# EAGLE design PCB-ACMSL (EAGLE 6.4)
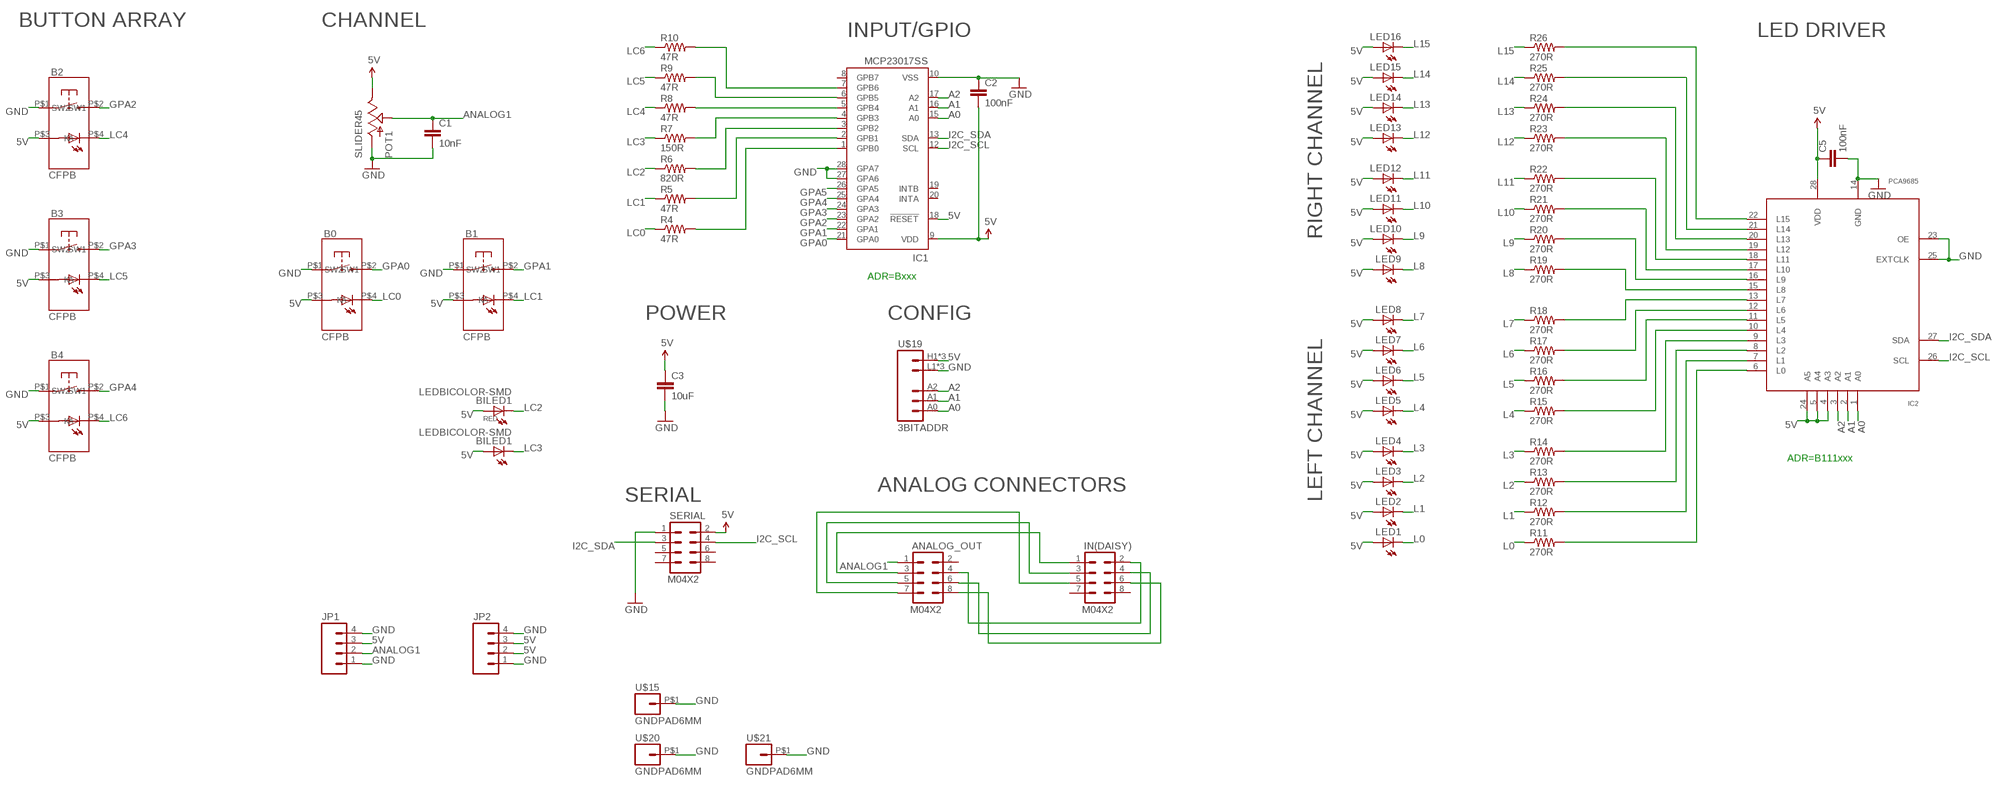
[diagram p0: schematic, sheet 1]

## Parts
ANALOG_OUT  M04X2  [2X4]
B0  CFPB  [CFPB-6/9MM]
B1  CFPB  [CFPB-6/9MM]
B2  CFPB  [CFPB-6/9MM]
B3  CFPB  [CFPB-6/9MM]
B4  CFPB  [CFPB-6/9MM]
BILED1  LEDBICOLOR-SMD  [LEDBICOLOR-SMD]
C1  10nF  CAP0603-CAP  [0603-CAP]
C2  100nF  CAP0603-CAP  [0603-CAP]
C3  10uF  CAP0805  [0805]
C5  100nF  CAP0603-CAP  [0603-CAP]
IC1  MCP23017SS  [SSOP28]
IC2  PCA9685  [TSSOP28]
IN(DAISY)  M04X2  [2X4]
JP1  M04PTH  [1X04]
JP2  M04PTH  [1X04]
LED1  LED3MM  [LED3MM]
LED2  LED3MM  [LED3MM]
LED3  LED3MM  [LED3MM]
LED4  LED3MM  [LED3MM]
LED5  LED3MM  [LED3MM]
LED6  LED3MM  [LED3MM]
LED7  LED3MM  [LED3MM]
LED8  LED3MM  [LED3MM]
LED9  LED3MM  [LED3MM]
LED10  LED3MM  [LED3MM]
LED11  LED3MM  [LED3MM]
LED12  LED3MM  [LED3MM]
LED13  LED3MM  [LED3MM]
LED14  LED3MM  [LED3MM]
LED15  LED3MM  [LED3MM]
LED16  LED3MM  [LED3MM]
POT1  SLIDER45  [SLIDER45]
R4  47R  RESISTOR0603-RES  [0603-RES]
R5  47R  RESISTOR0603-RES  [0603-RES]
R6  820R  RESISTOR0603-RES  [0603-RES]
R7  150R  RESISTOR0603-RES  [0603-RES]
R8  47R  RESISTOR0603-RES  [0603-RES]
R9  47R  RESISTOR0603-RES  [0603-RES]
R10  47R  RESISTOR0603-RES  [0603-RES]
R11  270R  RESISTOR0603-RES  [0603-RES]
R12  270R  RESISTOR0603-RES  [0603-RES]
R13  270R  RESISTOR0603-RES  [0603-RES]
R14  270R  RESISTOR0603-RES  [0603-RES]
R15  270R  RESISTOR0603-RES  [0603-RES]
R16  270R  RESISTOR0603-RES  [0603-RES]
R17  270R  RESISTOR0603-RES  [0603-RES]
R18  270R  RESISTOR0603-RES  [0603-RES]
R19  270R  RESISTOR0603-RES  [0603-RES]
R20  270R  RESISTOR0603-RES  [0603-RES]
R21  270R  RESISTOR0603-RES  [0603-RES]
R22  270R  RESISTOR0603-RES  [0603-RES]
R23  270R  RESISTOR0603-RES  [0603-RES]
R24  270R  RESISTOR0603-RES  [0603-RES]
R25  270R  RESISTOR0603-RES  [0603-RES]
R26  270R  RESISTOR0603-RES  [0603-RES]
SERIAL  M04X2  [2X4]
U$15  GNDPAD6MM  [3.2MMPAD6MM]
U$19  3BITADDR  [3BITADDR]
U$20  GNDPAD6MM  [3.2MMPAD6MM]
U$21  GNDPAD6MM  [3.2MMPAD6MM]

## Nets
5V [Power]: B0.P$3(A) B1.P$3(A) B2.P$3(A) B3.P$3(A) B4.P$3(A) BILED1.P$1(A) BILED1.P$3(A1) C2.2 C3.1 C5.1 IC1.9(VDD) IC1.18(!RESET) IC2.4(A3) IC2.5(A4) IC2.24(A5) IC2.28(VDD) JP1.3 JP2.2 JP2.3 LED1.A LED2.A LED3.A LED4.A LED5.A LED6.A LED7.A LED8.A LED9.A LED10.A LED11.A LED12.A LED13.A LED14.A LED15.A LED16.A POT1.1(E) SERIAL.2 U$19.H1(VCC) U$19.H2(VCC) U$19.H3(VCC)
A0: IC1.15(A0) IC2.1(A0) U$19.A0
A1: IC1.16(A1) IC2.2(A1) U$19.A1
A2: IC1.17(A2) IC2.3(A2) U$19.A2
ANALOG1: ANALOG_OUT.1 C1.1 JP1.2 POT1.2A(S)
GND [Power]: B0.P$1(SW1) B1.P$1(SW1) B2.P$1(SW1) B3.P$1(SW1) B4.P$1(SW1) C1.2 C2.1 C3.2 C5.2 IC1.10(VSS) IC1.27(GPA6) IC1.28(GPA7) IC2.14(GND) IC2.23(OE) IC2.25(EXTCLK) JP1.1 JP1.4 JP2.1 JP2.4 POT1.3(A) SERIAL.1 U$15.P$1 U$19.L1(GND) U$19.L2(GND) U$19.L3(GND) U$20.P$1 U$21.P$1
GPA0 [Signal]: B0.P$2(SW2) IC1.21(GPA0)
GPA1 [Signal]: B1.P$2(SW2) IC1.22(GPA1)
GPA2 [Signal]: B2.P$2(SW2) IC1.23(GPA2)
GPA3 [Signal]: B3.P$2(SW2) IC1.24(GPA3)
GPA4 [Signal]: B4.P$2(SW2) IC1.25(GPA4)
GPA5 [Signal]: IC1.26(GPA5)
I2C_SCL: IC1.12(SCL) IC2.26(SCL) SERIAL.4
I2C_SDA: IC1.13(SDA) IC2.27(SDA) SERIAL.3
L0: LED1.K(C) R11.1
L1: LED2.K(C) R12.1
L2: LED3.K(C) R13.1
L3: LED4.K(C) R14.1
L4: LED5.K(C) R15.1
L5: LED6.K(C) R16.1
L6: LED7.K(C) R17.1
L7: LED8.K(C) R18.1
L8: LED9.K(C) R19.1
L9: LED10.K(C) R20.1
L10: LED11.K(C) R21.1
L11: LED12.K(C) R22.1
L12: LED13.K(C) R23.1
L13: LED14.K(C) R24.1
L14: LED15.K(C) R25.1
L15: LED16.K(C) R26.1
LC0: B0.P$4(K) R4.1
LC1: B1.P$4(K) R5.1
LC2: BILED1.P$2(C) R6.1
LC3: BILED1.P$4(C1) R7.1
LC4: B2.P$4(K) R8.1
LC5: B3.P$4(K) R9.1
LC6: B4.P$4(K) R10.1
N$1: IC2.13(L7) R18.2
N$2: IC1.4(GPB3) R7.2
N$3: IC1.5(GPB4) R8.2
N$4: IC1.6(GPB5) R9.2
N$5: IC1.7(GPB6) R10.2
N$7: IC1.3(GPB2) R6.2
N$8: IC1.2(GPB1) R5.2
N$9: IC1.1(GPB0) R4.2
N$10: ANALOG_OUT.3 IN(DAISY).1
N$11: ANALOG_OUT.5 IN(DAISY).3
N$12: ANALOG_OUT.7 IN(DAISY).5
N$13: ANALOG_OUT.4 IN(DAISY).2
N$14: ANALOG_OUT.6 IN(DAISY).4
N$15: ANALOG_OUT.8 IN(DAISY).6
N$16: IC2.12(L6) R17.2
N$17: IC2.11(L5) R16.2
N$18: IC2.10(L4) R15.2
N$19: IC2.9(L3) R14.2
N$20: IC2.8(L2) R13.2
N$21: IC2.7(L1) R12.2
N$22: IC2.6(L0) R11.2
N$23: IC2.15(L8) R19.2
N$24: IC2.16(L9) R20.2
N$25: IC2.17(L10) R21.2
N$26: IC2.18(L11) R22.2
N$27: IC2.19(L12) R23.2
N$28: IC2.20(L13) R24.2
N$29: IC2.21(L14) R25.2
N$30: IC2.22(L15) R26.2
Unconnected: ANALOG_OUT.2 IC1.8(GPB7) IC1.19(INTB) IC1.20(INTA) IN(DAISY).7 IN(DAISY).8 SERIAL.5 SERIAL.6 SERIAL.7 SERIAL.8

## Notes on the sheet
- BUTTON ARRAY | CHANNEL
- INPUT/GPIO | LED DRIVER
- RIGHT CHANNEL
- ADR=Bxxx
- POWER | CONFIG
- ADR=B111xxx
- ANALOG CONNECTORS
- SERIAL | LEFT CHANNEL

## Library data of the parts
ANALOG_OUT IN(DAISY) SERIAL = SparkFun:M04X2
B0 B1-B4 = SKAARHOJ:CFPB
BILED1 = SKAARHOJ:LEDBICOLOR-SMD
C1-C3 C5 = SparkFun:CAP: Capacitor Standard 0603 ceramic capacitor, and 0.1" leaded capacitor.
IC1 = microchip:MCP23017: http://ww1.microchip.com/downloads/en/DeviceDoc/21952a.pdf Source: http://ww1.microchip.com/downloads/en/DeviceDoc/21952a.pdf; MF: MICROCHIP; MPN: MCP23017-E/SS; OC_FARNELL: 1467674; OC_NEWARK: 31K2960
IC2 = wsmith:PCA9685
JP1 JP2 = SparkFun:M04: Header 4 Standard 4-pin 0.1" header. Use with straight break away headers (SKU : PRT-00116), right angle break away headers (PRT-00553), swiss pins (PRT-00743), machine pins (PRT-00117), and female headers (PRT-00115). Molex polarized connector foot print use with SKU : PRT-08231 with associated crimp pins and housings. 1MM SMD Version SKU: PRT-10208
LED1-LED16 = SparkFun:LED: LEDs Standard schematic elements and footprints for 5mm, 3mm, 1206, and 0603 sized LEDs. 5mm - Spark Fun Electronics SKU : COM-00529 (and others)
POT1 = SKAARHOJ:SLIDER
R4-R26 = SparkFun:RESISTOR: Resistor Basic schematic elements and footprints for 0603, 1206, and PTH resistors.
U$15 U$20 U$21 = SKAARHOJ:GNDPAD
U$19 = SKAARHOJ:3BITADDR

## Net classes
0 default: width 0.203 mm, drill 0.406 mm, clearance 0.152 mm
1 Power: width 0.406 mm, drill 0.61 mm, clearance 0.203 mm
2 Signal: width 0.152 mm, clearance 0.152 mm

## Board
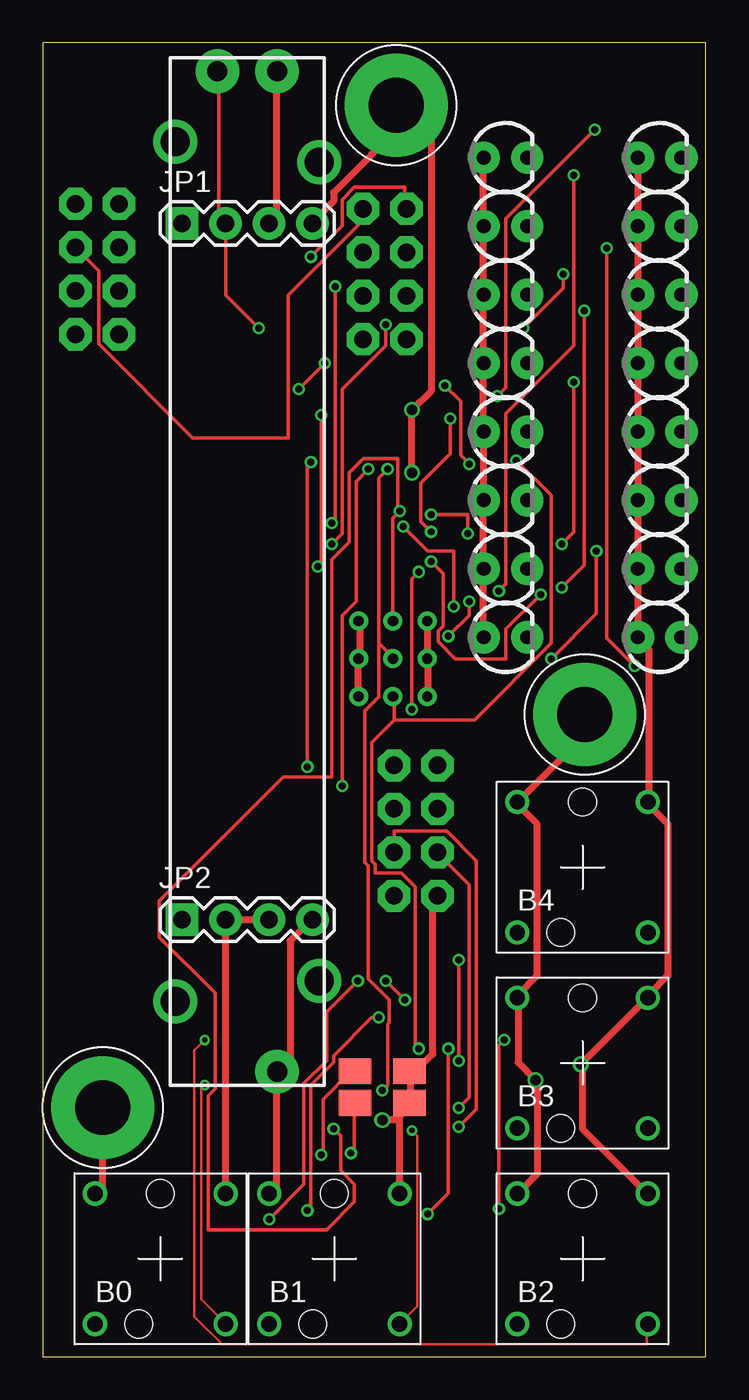
[diagram p1: board, top side]
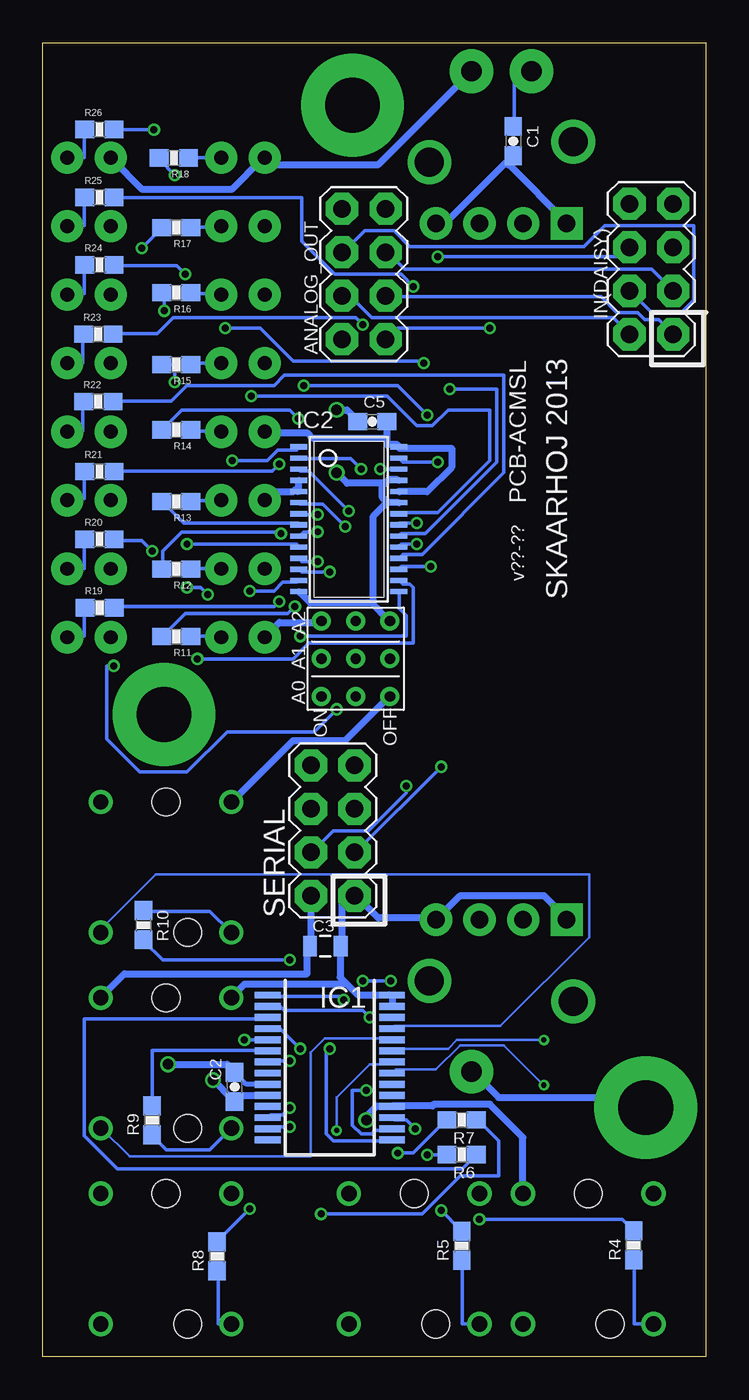
[diagram p2: board, bottom side, seen from below]

Size 38.69 x 76.71 mm. Coordinates in mm from the lower left corner, seen from the top.
Outline: 0,0 38.69,0 38.69,76.71 0,76.71 0,0
Copper layers (1*16): Top 0.035mm / dielectric 1.5mm / Bottom 0.035mm
Design rules "Fusion_eagle_rule_v1.1": minimum track width 6mil, minimum drill 12mil, track to track 6mil, track to pad 6mil, pad to pad 6mil, via to via 6mil, smd to smd 0mil, copper to edge 10mil, drill to drill 10mil, minimum pad ring 10mil, minimum via ring 6mil, stop-mask expansion 2mil, vias tented up to drill 100mil, thermal gap 10mil

### Footprints (pad centres in the part's own frame; a part is rotated, then mirrored left to right if it is on the bottom)
2X4 = drill 1.016 pad 1.88 octagon: 1 -3.81,-1.27; 2 -3.81,1.27; 3 -1.27,-1.27; 4 -1.27,1.27; 5 1.27,-1.27; 6 1.27,1.27; 7 3.81,-1.27; 8 3.81,1.27
CFPB-6/9MM = drill 0.9: P$1 -3.81,3.81; P$2 3.81,-3.81; P$3 3.81,3.81; P$4 -3.81,-3.81 | hole 1.6: 0,3.81; -1.27,-3.81
LEDBICOLOR-SMD = smd 1.9 x 1.5: P$1 1.6,0.925; P$2 -1.6,0.925; P$3 1.6,-0.925; P$4 -1.6,-0.925
0603-CAP = smd 1.1 x 1: 1 -0.85,0; 2 0.85,0
0805 = smd 0.8 x 1.2: 1 -0.9,0; 2 0.9,0
SSOP28 = smd 0.4 x 1.5: 1 -4.225,-3.625; 2 -3.575,-3.625; 3 -2.925,-3.625; 4 -2.275,-3.625; 5 -1.625,-3.625; 6 -0.975,-3.625; 7 -0.325,-3.625; 8 0.325,-3.625; 9 0.975,-3.625; 10 1.625,-3.625; 11 2.275,-3.625; 12 2.925,-3.625; 13 3.575,-3.625; 14 4.225,-3.625; 15 4.225,3.625; 16 3.575,3.625; 17 2.925,3.625; 18 2.275,3.625; 19 1.625,3.625; 20 0.975,3.625; 21 0.325,3.625; 22 -0.325,3.625; 23 -0.975,3.625; 24 -1.625,3.625; 25 -2.275,3.625; 26 -2.925,3.625; 27 -3.575,3.625; 28 -4.225,3.625
TSSOP28 = smd 0.305 x 0.991: 1 -4.225,-2.918; 2 -3.575,-2.918; 3 -2.925,-2.918; 4 -2.275,-2.918; 5 -1.625,-2.918; 6 -0.975,-2.918; 7 -0.325,-2.918; 8 0.325,-2.918; 9 0.975,-2.918; 10 1.625,-2.918; 11 2.275,-2.918; 12 2.925,-2.918; 13 3.575,-2.918; 14 4.225,-2.918; 15 4.225,2.918; 16 3.575,2.918; 17 2.925,2.918; 18 2.275,2.918; 19 1.625,2.918; 20 0.975,2.918; 21 0.325,2.918; 22 -0.325,2.918; 23 -0.975,2.918; 24 -1.625,2.918; 25 -2.275,2.918; 26 -2.925,2.918; 27 -3.575,2.918; 28 -4.225,2.918
1X04 = drill 1.016 pad 1.88 square: 1 0,0 | drill 1.016 pad 1.88: 2 2.54,0; 3 5.08,0; 4 7.62,0
LED3MM = drill 0.813 pad 1.88: A -1.27,0; K 1.27,0
SLIDER45 = drill 1.194 pad 2.54: 1 -29.21,1.75; 2A -29.21,-1.75; 3 29.21,1.75 | drill 1.702: P$1 -23.9,4.2; P$2 23.9,4.2; P$3 25.1,-4.2; P$4 -25.1,-4.2
0603-RES = smd 1.1 x 1: 1 -0.85,0; 2 0.85,0
3.2MMPAD6MM = drill 3.2 pad 6: P$1 0,0
3BITADDR = drill 0.6: A0 -2.2,0; A1 0,0; A2 2.2,0; H1 -2.2,2; H2 0,2; H3 2.2,2; L1 -2.2,-2; L2 0,-2; L3 2.2,-2

### Placement (x,y rotation side)
ANALOG_OUT  19.95,63.21 90 bottom
B0  6.86,5.71 0 top
B1  17.02,5.71 0 top
B2  31.5,5.71 0 top
B3  31.5,17.14 0 top
B4  31.5,28.57 0 top
BILED1  19.81,15.75 0 top
C1  11.23,70.97 270 bottom
C2  27.5,15.74 90 bottom
C3  22.2,23.98 0 bottom
C5  19.47,54.59 180 bottom
IC1  21.94,16.88 270 bottom
IC2  20.83,48.89 270 bottom
IN(DAISY)  3.17,63.5 90 bottom
JP1  8.12,66.16 0 top
JP2  8.12,25.52 0 top
LED1  27,42 0 top
LED2  27,46 0 top
LED3  27,50 0 top
LED4  27,54 0 top
LED5  27,58 0 top
LED6  27,62 0 top
LED7  27,66 0 top
LED8  27,70 0 top
LED9  36,42 0 top
LED10  36,46 0 top
LED11  36,50 0 top
LED12  36,54 0 top
LED13  36,58 0 top
LED14  36,62 0 top
LED15  36,66 0 top
LED16  36,70 0 top
POT1  11.93,45.84 270 top
R4  4.2,6.5 90 bottom
R5  14.23,6.47 90 bottom
R6  14.25,11.8 0 bottom
R7  14.25,13.82 0 bottom
R8  28.52,5.86 90 bottom
R9  32.31,13.79 90 bottom
R10  32.82,25.2 270 bottom
R11  30.91,42.05 180 bottom
R12  30.91,45.98 180 bottom
R13  30.91,49.92 180 bottom
R14  30.91,54.11 180 bottom
R15  30.91,57.92 180 bottom
R16  30.91,62.11 180 bottom
R17  30.91,65.92 180 bottom
R18  31.04,69.99 180 bottom
R19  35.36,43.73 0 bottom
R20  35.38,47.73 0 bottom
R21  35.38,51.68 0 bottom
R22  35.45,55.76 0 bottom
R23  35.45,59.7 0 bottom
R24  35.38,63.74 0 bottom
R25  35.38,67.68 0 bottom
R26  35.38,71.65 0 bottom
SERIAL  21.77,30.71 90 bottom
U$15  3.5,14.54 0 top
U$19  20.43,40.75 90 bottom
U$20  20.62,73.06 0 top
U$21  31.62,37.5 0 top

### Tracks (layer width: path | path; a pad name or v marks a point on that pad's centre or on a via)
5V  (via drill 0.61)
  Top 0.406: U$19.H1 22.45,38.61 22.45,40.74 U$19.H2 22.45,40.95 22.45,42.88 U$19.H3 | LED1.A 25.7,42.06 25.7,45.92 LED2.A 25.7,46.13 25.7,49.99 LED3.A 25.7,50.19 25.7,53.85 LED4.A 25.7,54.05 25.7,57.91 LED5.A 25.7,58.22 25.7,61.98 LED6.A 25.7,62.18 25.7,65.94 LED7.A 25.7,66.14 25.7,69.9 LED8.A | JP1.3 13.21,66.24 13.61,66.65 13.61,74.98 POT1.1 | JP2.3 13.11,25.5 10.67,25.5 JP2.2 10.67,25.3 B0.P$3 | B1.P$3 20.83,13.82 | 20.83,13.82 20.83,14.02 21.44,14.63 BILED1.P$3 21.44,14.83 21.44,16.66 BILED1.P$1 21.54,16.46 22.76,17.68 22.76,26.62 22.96,26.82 SERIAL.2 | B2.P$3 35.26,9.55 31.5,13.31 31.5,16.97 v31.39,17.07 35.26,20.93 B3.P$3 35.36,21.13 36.47,22.25 36.47,31.09 35.36,32.21 B4.P$3 35.36,32.41 35.36,41.35 34.75,41.96 LED9.A 34.75,42.16 34.75,45.92 LED10.A 34.75,46.13 34.75,49.99 LED11.A 34.75,50.19 34.75,53.95 LED12.A 34.75,54.15 34.75,57.91 LED13.A 34.75,58.12 34.75,61.98 LED14.A 34.75,62.18 34.75,65.94 LED15.A 34.75,66.14 34.75,69.9 LED16.A | 20.83,13.82 v19.81,13.82
  Bottom 0.305: IC1.9 26.81,15.9 C2.2
  Bottom 0.406: IC2.4 23.77,51.1 23.77,50.6 IC2.5 23.98,50.6 24.08,50.49 25.3,50.49 25.7,50.09 LED3.A | U$19.H3 22.45,42.88 24.89,42.88 25.7,42.06 LED1.A | IC2.24 17.88,50.49 16.26,50.49 14.83,51.92 14.83,53.03 17.88,53.03 IC2.28 17.98,53.24 18.59,53.24 18.59,53.65 | 18.59,53.65 18.59,54.56 C5.1 | 18.59,53.65 22.96,53.65 23.27,53.95 25.7,53.95 LED4.A | POT1.1 13.72,74.98 19.1,69.6 25.4,69.6 25.7,69.9 LED8.A 25.91,69.9 27.64,68.17 32.92,68.17 34.65,69.9 LED16.A | B0.P$3 10.67,12.8 12.6,14.73 15.85,14.73 15.95,14.63 18.29,14.63 IC1.18 18.49,14.63 19.2,14.63 19.81,14.02 v19.81,13.82 | SERIAL.2 23.06,26.82 23.06,24.08 C3.1 23.27,23.88 23.27,22.35 33.93,22.35 35.26,21.03 B3.P$3 | v31.39,17.07 27.94,17.07 27.53,16.66 C2.2
A0  (via drill 0.41)
  Top 0.203: v27.64,52.32 29.67,50.29 29.67,41.66 25.2,37.19 20.52,37.19 | 20.52,37.19 20.52,38.51 U$19.A0 | v21.95,17.98 21.74,18.19 21.74,27.43 20.93,28.25 19.41,28.25 19.41,28.75 19.2,28.96 19.2,35.87 20.52,37.19
  Bottom 0.203: v27.64,52.32 25.6,52.32 24.99,52.93 23.88,52.93 23.77,53.03 IC2.1 | v21.95,17.98 22.15,17.98 22.15,13.01 21.74,12.6 18.39,12.6 IC1.15
A1  (via drill 0.41)
  Top 0.203: v20.12,51.82 19.61,51.31 19.61,41.66 19.66,41.6 | 19.66,41.6 20.42,40.84 U$19.A1 | v19.81,15.54 20.12,15.85 20.12,19.41 20.22,19.51 20.22,20.83 19,22.05 19,28.65 18.8,28.85 18.8,37.69 19.61,38.51 19.61,41.55 19.66,41.6
  Bottom 0.203: v20.12,51.82 20.73,52.43 23.67,52.43 IC2.2 | v19.81,15.54 20.62,15.54 20.62,13.51 20.12,13.01 19.51,13.01 19.3,13.21 18.39,13.21 IC1.16
A2  (via drill 0.41)
  Top 0.203: U$19.A2 20.42,42.98 20.42,48.97 v20.83,49.38 20.73,49.38 20.73,52.43 18.69,52.43 17.88,51.61 17.88,47.55 16.87,46.53 16.87,33.83 14.02,33.83 6.81,26.62 6.81,24.49 10.06,21.23 10.06,15.65 9.65,15.24 9.65,7.42 16.56,7.42 18.19,9.04 18.19,10.06 17.37,10.87 17.37,12.9 v16.97,13.31
  Bottom 0.203: v20.83,49.38 23.16,51.71 23.67,51.71 IC2.3 | v16.97,13.31 17.48,13.82 18.19,13.82 18.29,13.92 IC1.17
ANALOG1  (via drill 0.41)
  Top 0.203: POT1.2A 10.26,74.98 10.26,66.55 10.57,66.24 JP1.2 10.67,66.14 10.67,61.98 v12.6,60.05
  Bottom 0.203: C1.1 11.18,71.83 11.18,74.98 10.26,74.98 POT1.2A | v12.6,60.05 17.98,60.05 18.59,59.44 ANALOG_OUT.1
GND  (via drill 0.61)
  Top 0.406: JP1.4 15.75,66.24 16.97,67.46 16.97,67.97 21.23,72.24 U$20.P$1 22.66,71.02 22.66,56.39 v21.54,55.27 v21.54,51.61 | U$19.L1 18.39,38.61 18.39,40.74 U$19.L2 18.49,40.95 18.49,42.88 U$19.L3 | U$21.P$1 31.6,37.49 31.6,36.27 27.74,32.41 B4.P$1 27.74,32.21 28.85,31.09 28.85,22.25 27.74,21.13 B3.P$1 27.74,20.93 27.74,17.17 v28.75,16.15 28.85,16.05 28.85,10.67 27.74,9.55 B2.P$1 | B0.P$1 3.05,9.55 3.45,9.96 3.45,14.53 U$15.P$1 | B1.P$1 13.21,9.55 13.61,9.96 13.61,16.56 POT1.3 13.82,16.76 14.43,17.37 14.43,24.28 15.65,25.5 JP2.4
  Bottom 0.406: JP1.4 15.65,66.24 15.14,66.24 11.28,70.1 C1.2 11.58,69.6 11.48,69.6 8.13,66.24 JP1.1 | v21.54,55.27 20.93,55.27 20.32,54.66 C5.2 | 18.59,49.89 17.98,49.89 IC2.23 | 18.59,49.89 18.9,50.19 18.9,51 | 18.9,51 18.69,51 18.49,51.21 17.98,51.21 IC2.25 | 19.51,43.99 23.06,43.99 23.67,44.6 IC2.14 | 19.51,43.99 18.49,42.98 U$19.L3 | 18.59,49.89 19.41,49.07 19.41,44.09 19.51,43.99 | U$19.L1 18.49,38.51 21.03,35.97 24.08,35.97 27.64,32.41 B4.P$1 | IC1.10 25.6,15.24 27.13,15.24 27.43,14.94 C2.1 27.64,15.04 v28.75,16.15 | IC1.27 18.29,20.52 18.29,21.03 IC1.28 18.49,21.13 20.32,21.13 21.03,21.84 | 21.03,21.84 21.34,22.15 21.34,23.77 C3.2 21.23,24.08 21.23,26.82 20.52,26.82 SERIAL.1 20.32,26.82 19.1,25.6 15.85,25.6 JP2.4 15.65,25.6 14.33,26.92 9.45,26.92 8.13,25.6 JP2.1 | B3.P$1 27.64,21.03 26.92,21.74 21.13,21.74 21.03,21.84 | U$15.P$1 3.56,14.63 4.06,15.14 12.09,15.14 13.51,16.56 13.61,16.56 POT1.3 | v21.54,51.61 20.93,51 18.9,51
GPA0  (via drill 0.3)
  Top 0.152: v9.45,15.85 9.25,15.65 9.25,3.35 10.67,1.93 B0.P$2
  Bottom 0.152: v9.45,15.85 11.79,18.19 14.33,18.19 15.75,16.76 18.09,16.76 18.29,16.56 IC1.21
GPA1  (via drill 0.3)
  Top 0.152: v21.54,13.21 21.84,12.9 21.84,2.95 20.83,1.93 B1.P$2
  Bottom 0.152: v21.54,13.21 21.54,15.14 19.61,17.07 18.49,17.07 18.39,17.17 IC1.22
GPA2  (via drill 0.3)
  Top 0.152: v9.45,18.49 8.84,17.88 8.84,2.34 10.46,0.71 35.26,0.71 35.26,1.83 B2.P$2
  Bottom 0.152: v9.45,18.49 14.53,18.49 15.04,17.98 18.19,17.98 18.29,17.88 IC1.23
GPA3
  Bottom 0.152: IC1.24 18.39,18.59 22.25,18.59 23.06,17.78 23.06,11.68 33.63,11.68 35.26,13.31 B3.P$2
GPA4
  Bottom 0.152: IC1.25 18.29,19.2 18.19,19.3 11.99,19.3 6.81,24.49 6.81,28.14 32.11,28.14 35.26,24.99 35.26,24.79 B4.P$2
I2C_SCL  (via drill 0.41)
  Top 0.203: v19,51.82 18.29,51.1 18.29,44.09 17.48,43.28 v17.48,33.33 | v24.28,14.53 24.89,15.14 24.89,27.53 23.06,29.36 SERIAL.4
  Bottom 0.203: v19,51.82 17.98,51.82 IC2.26 | v17.48,33.33 17.48,32.92 19.71,30.68 21.74,30.68 22.96,29.46 SERIAL.4 | v24.28,14.53 24.69,14.12 25.4,14.12 25.5,14.02 IC1.12
I2C_SDA  (via drill 0.41)
  Top 0.203: v15.65,52.22 15.44,52.02 v15.44,34.44 | v24.28,13.41 25.3,14.43 25.3,28.96 23.57,30.68 20.52,30.68 20.52,29.46 SERIAL.3
  Bottom 0.203: v15.65,52.22 17.68,52.22 17.88,52.43 IC2.27 | v15.44,34.44 20.42,29.46 SERIAL.3 | v24.28,13.41 25.4,13.41 25.5,13.31 IC1.13
L0
  Bottom 0.203: R11.1 29.97,42.06 28.35,42.06 LED1.K
L1
  Bottom 0.203: R12.1 29.97,46.02 28.35,46.02 LED2.K
L2
  Bottom 0.203: R13.1 29.97,49.99 28.35,49.99 LED3.K
L3
  Bottom 0.203: R14.1 29.97,54.05 28.35,54.05 LED4.K
L4
  Bottom 0.203: R15.1 29.97,58.01 28.35,58.01 LED5.K
L5
  Bottom 0.203: R16.1 29.97,62.08 28.35,62.08 LED6.K
L6
  Bottom 0.203: R17.1 29.97,65.94 28.35,65.94 LED7.K
L7
  Bottom 0.203: R18.1 30.18,70 28.35,70 LED8.K
L8
  Bottom 0.203: R19.1 36.27,43.69 36.27,42.06 37.19,42.06 LED9.K
L9
  Bottom 0.203: R20.1 36.27,47.65 36.27,46.02 37.19,46.02 LED10.K
L10
  Bottom 0.203: R21.1 36.27,51.61 36.27,50.09 37.19,50.09 LED11.K
L11
  Bottom 0.203: R22.1 36.37,55.68 36.37,54.05 37.19,54.05 LED12.K
L12
  Bottom 0.203: R23.1 36.37,59.64 36.37,58.01 37.19,58.01 LED13.K
L13
  Bottom 0.203: R24.1 36.27,63.7 36.27,62.08 37.19,62.08 LED14.K
L14
  Bottom 0.203: R25.1 36.27,67.67 36.27,66.04 37.19,66.04 LED15.K
L15
  Bottom 0.203: R26.1 36.27,71.63 36.27,70 37.19,70 LED16.K
LC0
  Bottom 0.203: R4.1 4.17,5.59 4.17,1.93 3.05,1.93 B0.P$4
LC1
  Bottom 0.203: R5.1 14.22,5.59 14.22,1.93 13.21,1.93 B1.P$4
LC2  (via drill 0.41)
  Top 0.203: v16.26,11.79 16.36,11.89 16.36,15.04 17.98,16.66 18.19,16.66 BILED1.P$2
  Bottom 0.203: v16.26,11.79 15.14,11.79 R6.1
LC3  (via drill 0.41)
  Top 0.203: v17.98,11.89 18.19,12.09 18.19,14.73 BILED1.P$4
  Bottom 0.203: v17.98,11.89 17.07,11.89 15.14,13.82 R7.1
LC4
  Bottom 0.203: R8.1 28.45,4.98 28.45,1.93 27.74,1.93 B2.P$4
LC5
  Bottom 0.203: R9.1 32.31,12.9 31.5,12.09 28.96,12.09 27.74,13.31 B3.P$4
LC6
  Bottom 0.203: R10.1 32.82,26.01 28.96,26.01 27.74,24.79 B4.P$4
N$1  (via drill 0.41)
  Top 0.203: v26.62,44.7 27.03,45.11 27.03,55.07 30.99,59.03 v30.99,68.99
  Bottom 0.203: v26.62,44.7 25.2,44.7 24.69,45.21 23.88,45.21 23.77,45.31 IC2.13 | v30.99,68.99 31.9,69.9 R18.2
N$2  (via drill 0.41)
  Top 0.203: v22.45,8.33 23.67,9.55 v23.67,17.98
  Bottom 0.203: v22.45,8.33 16.56,8.33 14.33,10.57 12.09,10.57 12.09,12.6 13.31,13.82 R7.2 | v23.67,17.98 24.79,19.1 25.5,19.1 IC1.4
N$3  (via drill 0.41)
  Top 0.203: v26.62,8.64 26.62,18.19 v26.92,18.49
  Bottom 0.203: v26.62,8.64 28.45,6.81 R8.2 | v26.92,18.49 25.6,18.49 IC1.5
N$4
  Bottom 0.203: R9.2 32.31,14.73 32.31,17.88 25.6,17.88 IC1.6
N$5  (via drill 0.41)
  Top 0.203: v24.28,17.27 v24.28,23.16
  Bottom 0.203: v24.28,23.16 31.7,23.16 32.82,24.28 R10.2 | v24.28,17.27 25.5,17.27 IC1.7
N$7
  Bottom 0.203: R6.2 13.41,11.79 14.22,10.97 34.34,10.97 36.27,12.9 36.27,19.71 25.6,19.71 IC1.3
N$8  (via drill 0.41)
  Top 0.203: v15.44,8.53 15.65,8.74 15.65,15.85 16.97,17.17 16.97,17.58 19.2,19.81 v19.61,19.81
  Bottom 0.203: v15.44,8.53 14.33,7.42 R5.2 | v19.61,19.81 20.02,20.22 24.59,20.22 24.79,20.42 25.5,20.42 IC1.2
N$9  (via drill 0.41)
  Top 0.203: v13.21,8.03 15.24,10.06 15.24,15.95 16.56,17.27 16.56,20.12 v18.39,21.95 | v21.13,20.83 v20.02,21.95
  Bottom 0.203: v13.21,8.03 4.88,8.03 4.27,7.42 R4.2 | v20.02,21.95 v18.39,21.95 | v21.13,20.83 21.34,21.03 25.5,21.03 IC1.1
N$10
  Bottom 0.203: IN(DAISY).1 1.93,59.74 2.74,60.55 3.56,60.55 3.96,60.96 5.18,60.96 6.1,61.87 18.59,61.87 ANALOG_OUT.3
N$11
  Bottom 0.203: IN(DAISY).3 1.93,62.28 3.15,63.5 17.58,63.5 18.49,64.41 18.59,64.41 ANALOG_OUT.5
N$12
  Top 0.203: IN(DAISY).5 1.93,64.72 3.25,63.4 3.25,59.13 8.74,53.65 14.33,53.65 14.33,61.98 18.59,66.24 18.59,66.95 ANALOG_OUT.7
N$13
  Bottom 0.203: IN(DAISY).2 4.47,59.74 5.38,60.66 19.51,60.66 20.73,61.87 21.13,61.87 ANALOG_OUT.4
N$14
  Bottom 0.203: IN(DAISY).4 4.37,62.18 3.15,60.96 1.42,60.96 0.71,61.67 0.71,66.04 5.89,66.04 7.11,64.82 17.27,64.82 18.19,65.73 19.91,65.73 21.13,64.52 ANALOG_OUT.6
N$15  (via drill 0.41)
  Top 0.203: v15.65,64.21 17.48,66.04 17.48,67.56 18.19,68.28 21.13,68.28 21.13,67.06 ANALOG_OUT.8
  Bottom 0.203: v15.65,64.21 4.98,64.21 4.47,64.72 IN(DAISY).6
N$16  (via drill 0.41)
  Top 0.203: v21.95,45.82 21.54,45.41 v21.54,37.8 | v34.54,40.34 32.92,41.96 v32.92,64.72
  Bottom 0.203: v21.95,45.82 23.57,45.82 23.67,45.92 IC2.12 | v21.54,37.8 22.86,36.47 27.94,36.47 30.28,34.14 33.02,34.14 34.95,36.07 34.95,40.34 v34.54,40.34 | v32.92,64.72 31.8,65.84 R17.2
N$17  (via drill 0.41)
  Top 0.203: v22.66,46.43 23.37,45.72 23.37,42.67 23.06,42.37 23.06,41.76 24.08,40.74 27.03,40.74 27.03,42.47 v29.06,44.5 | v30.28,44.91 31.6,46.23 v31.6,61.06
  Bottom 0.203: v22.66,46.43 23.57,46.43 23.67,46.53 IC2.11 | v29.06,44.5 29.46,44.91 v30.28,44.91 | v31.6,61.06 31.6,62.08 31.7,62.08 R16.2
N$18  (via drill 0.41)
  Top 0.203: v30.28,47.45 30.99,48.16 v30.99,56.9
  Bottom 0.203: v30.28,47.45 23.88,47.45 23.77,47.35 IC2.10 | v30.99,56.9 30.99,57.91 31.7,57.91 R15.2
N$19  (via drill 0.41)
  Top 0.203: v22.66,48.16 22.05,48.77 22.05,51 23.77,52.73 v23.77,54.76
  Bottom 0.203: v22.66,48.16 23.47,48.16 23.67,47.95 IC2.9 | v23.77,54.76 24.28,55.27 30.58,55.27 31.7,54.15 R14.2
N$20
  Bottom 0.203: IC2.8 23.77,48.67 30.48,48.67 31.7,49.89 R13.2
N$21  (via drill 0.41)
  Top 0.203: v22.66,49.17 24.79,49.17 v24.79,48.06
  Bottom 0.203: v22.66,49.17 23.67,49.17 IC2.7 | v24.79,48.06 24.89,48.16 30.58,48.16 31.7,47.04 31.7,46.02 R12.2
N$22  (via drill 0.41)
  Top 0.203: v21.03,48.46 22.45,47.04 23.98,47.04 v23.98,43.79
  Bottom 0.203: v21.03,48.46 22.35,49.78 23.67,49.78 IC2.6 | v23.98,43.79 24.38,43.38 30.38,43.38 31.7,42.06 R11.2
N$23  (via drill 0.41)
  Top 0.203: v23.67,42.06 24.89,43.28 v24.89,44.09
  Bottom 0.203: v23.67,42.06 17.48,42.06 17.48,43.28 17.88,43.69 17.88,44.6 IC2.15 | v24.89,44.09 25.2,43.79 34.44,43.79 R19.2
N$24  (via drill 0.41)
  Top 0.203: v29.67,40.74 32.31,43.38 v32.31,47.04
  Bottom 0.203: v29.67,40.74 24.08,40.74 23.16,41.66 17.07,41.66 17.07,44.91 17.27,45.11 17.68,45.11 17.88,45.31 IC2.16 | v32.31,47.04 32.92,47.65 34.44,47.65 R20.2
N$25  (via drill 0.41)
  Top 0.203: v16.05,46.13 16.26,46.33 v16.26,54.97 | v23.47,56.69 24.38,55.78 24.38,52.63 v24.89,52.12
  Bottom 0.203: v16.05,46.13 17.78,46.13 17.88,46.02 IC2.17 | v16.26,54.97 17.98,56.69 v23.47,56.69 | v24.89,52.12 25.3,51.71 34.44,51.71 R21.2
N$26
  Bottom 0.203: IC2.18 17.88,46.63 17.68,46.84 16.56,46.84 11.79,51.61 11.79,57.3 24.59,57.3 25.2,56.69 30.28,56.69 31.19,55.78 34.54,55.78 R22.2
N$27  (via drill 0.41)
  Top 0.203: v16.87,47.45 17.48,48.06 17.48,56.49 20.02,59.03 v20.02,60.25
  Bottom 0.203: v16.87,47.45 17.78,47.45 17.88,47.35 IC2.19 | v20.02,60.25 20.42,60.66 31.09,60.66 32,59.74 34.54,59.74 R23.2
N$28  (via drill 0.41)
  Top 0.203: v16.46,58.01 v14.94,56.49 | v28.04,60.05 30.38,62.38 v30.38,63.2
  Bottom 0.203: v14.94,56.49 12.19,56.49 12.19,52.22 16.36,48.06 17.78,48.06 17.88,47.95 IC2.20 | v16.46,58.01 16.56,58.12 24.08,58.12 26.01,60.05 v28.04,60.05 | v30.38,63.2 30.89,63.7 34.44,63.7 R24.2
N$29  (via drill 0.41)
  Top 0.203: v16.87,48.67 17.07,48.87 v17.07,62.48
  Bottom 0.203: v16.87,48.67 17.88,48.67 IC2.21 | v17.07,62.48 17.78,63.2 21.64,63.2 23.57,65.13 23.57,67.67 34.44,67.67 R25.2
N$30  (via drill 0.41)
  Top 0.203: v26.52,56.08 27.03,56.59 27.03,66.45 v32.21,71.63
  Bottom 0.203: v26.52,56.08 18.59,56.08 16.87,54.36 15.95,54.36 15.04,55.27 12.6,55.27 12.6,52.32 15.65,49.28 17.88,49.28 IC2.22 | v32.21,71.63 34.44,71.63 R26.2

### Text on the board
_bsilk: SKAARHOJ 2013 | PCB-ACMSL | v??-??